# EAGLE design Mini_Door_Client (EAGLE 7.5.0)
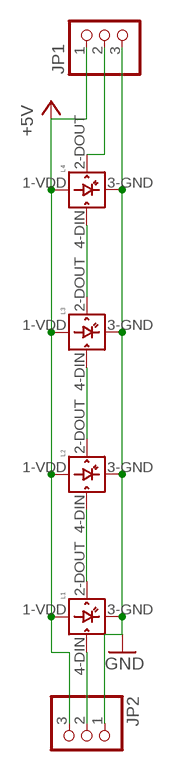
[diagram p0: schematic, sheet 1]

## Parts
JP1  PINHD-1X3  [1X03]
JP2  PINHD-1X3  [1X03]
L1  WS2812B  [WS2812B]
L2  WS2812B  [WS2812B]
L3  WS2812B  [WS2812B]
L4  WS2812B  [WS2812B]

## Nets
+5V: JP1.1 JP2.3 L1.1-VDD(VDD) L2.1-VDD(VDD) L3.1-VDD(VDD) L4.1-VDD(VDD)
GND: JP1.3 JP2.1 L1.3-GND(GND) L2.3-GND(GND) L3.3-GND(GND) L4.3-GND(GND)
N$1: L1.2-DOUT(DOUT) L2.4-DIN(DIN)
N$2: L2.2-DOUT(DOUT) L3.4-DIN(DIN)
N$3: L3.2-DOUT(DOUT) L4.4-DIN(DIN)
N$4: JP1.2 L4.2-DOUT(DOUT)
N$5: JP2.2 L1.4-DIN(DIN)

## Library data of the parts
JP1 JP2 = adafruit:PINHD-1X3: PIN HEADER
L1-L4 = adafruit:WS2812B

## Board
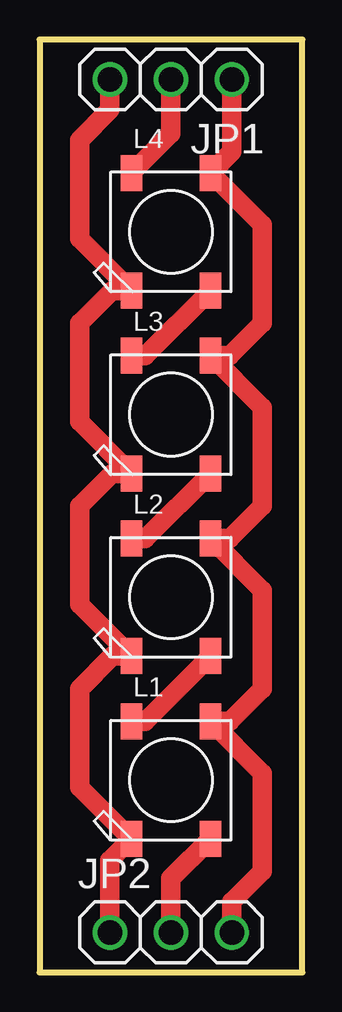
[diagram p1: board, top side]

No outline drawn. Coordinates in mm, seen from the top.
Copper layers (1*16): Top 0.035mm / dielectric 1.5mm / Bottom 0.035mm
Design rules "default": minimum track width 0.4mm, minimum drill 24mil, track to track 0.4mm, track to pad 0.4mm, pad to pad 0.4mm, via to via 0.4mm, smd to smd 8mil, copper to edge 40mil, drill to drill 8mil, minimum pad ring 5mil, minimum via ring 8mil, stop-mask expansion 4mil, vias tented up to drill 0mil, thermal gap 0.4mm
Milling: 4 lines

### Footprints (pad centres in the part's own frame; a part is rotated, then mirrored left to right if it is on the bottom)
1X03 = drill 1.016: 1 -2.54,0; 2 0,0; 3 2.54,0
WS2812B = smd 1.5 x 0.9: 1-VDD 2.45,-1.65; 2-DOUT 2.45,1.65; 3-GND -2.45,1.65; 4-DIN -2.45,-1.65

### Placement (x,y rotation side)
JP1  5.08,36.83 180 top
JP2  5.08,1.27 0 top
L1  5.08,7.62 90 top
L2  5.08,15.24 90 top
L3  5.08,22.86 90 top
L4  5.08,30.48 90 top

### Tracks (layer width: path | path; a pad name or v marks a point on that pad's centre or on a via)
+5V
  Top 0.813: JP2.3 7.62,2.54 8.89,3.81 8.89,7.91 L1.1-VDD 7.53,10.07 8.89,11.43 8.89,15.53 L2.1-VDD 7.53,17.69 8.89,19.05 8.89,23.15 L3.1-VDD 7.53,25.31 8.89,26.67 8.89,30.77 L4.1-VDD 7.62,33.82 JP1.1
GND
  Top 0.813: JP2.1 2.54,4.28 L1.3-GND 1.27,7.33 1.27,11.43 2.63,12.79 L2.3-GND 1.27,14.95 1.27,19.05 2.63,20.41 L3.3-GND 1.27,22.57 1.27,26.67 2.63,28.03 L4.3-GND 1.27,30.19 1.27,34.29 2.54,35.56 JP1.3
N$1
  Top 0.813: L1.2-DOUT 4.01,10.07 L2.4-DIN
N$2
  Top 0.813: L2.2-DOUT 4.01,17.69 L3.4-DIN
N$3
  Top 0.813: L3.2-DOUT 4.01,25.31 L4.4-DIN
N$4
  Top 0.813: L4.2-DOUT 5.08,34.58 JP1.2
N$5
  Top 0.813: JP2.2 5.08,3.52 L1.4-DIN